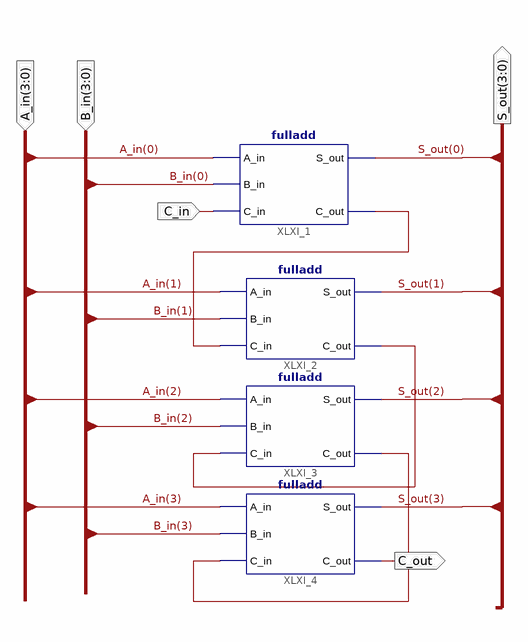
[diagram p0: schematic sheet 1]
// Xilinx ISE schematic fulladd4.sch (spartan6) as structural Verilog: 4 symbols, 5 ports
module fulladd4 (
  input  C_in,
  input  [3:0] A_in,
  input  [3:0] B_in,
  output C_out,
  output [3:0] S_out
);

  wire XLXN_1, XLXN_2, XLXN_3;

  fulladd XLXI_1 (.A_in(A_in[0]), .B_in(B_in[0]), .C_in(C_in), .S_out(S_out[0]), .C_out(XLXN_1));
  fulladd XLXI_2 (.A_in(A_in[1]), .B_in(B_in[1]), .C_in(XLXN_1), .S_out(S_out[1]), .C_out(XLXN_2));
  fulladd XLXI_3 (.A_in(A_in[2]), .B_in(B_in[2]), .C_in(XLXN_2), .S_out(S_out[2]), .C_out(XLXN_3));
  fulladd XLXI_4 (.A_in(A_in[3]), .B_in(B_in[3]), .C_in(XLXN_3), .S_out(S_out[3]), .C_out(C_out));
endmodule
